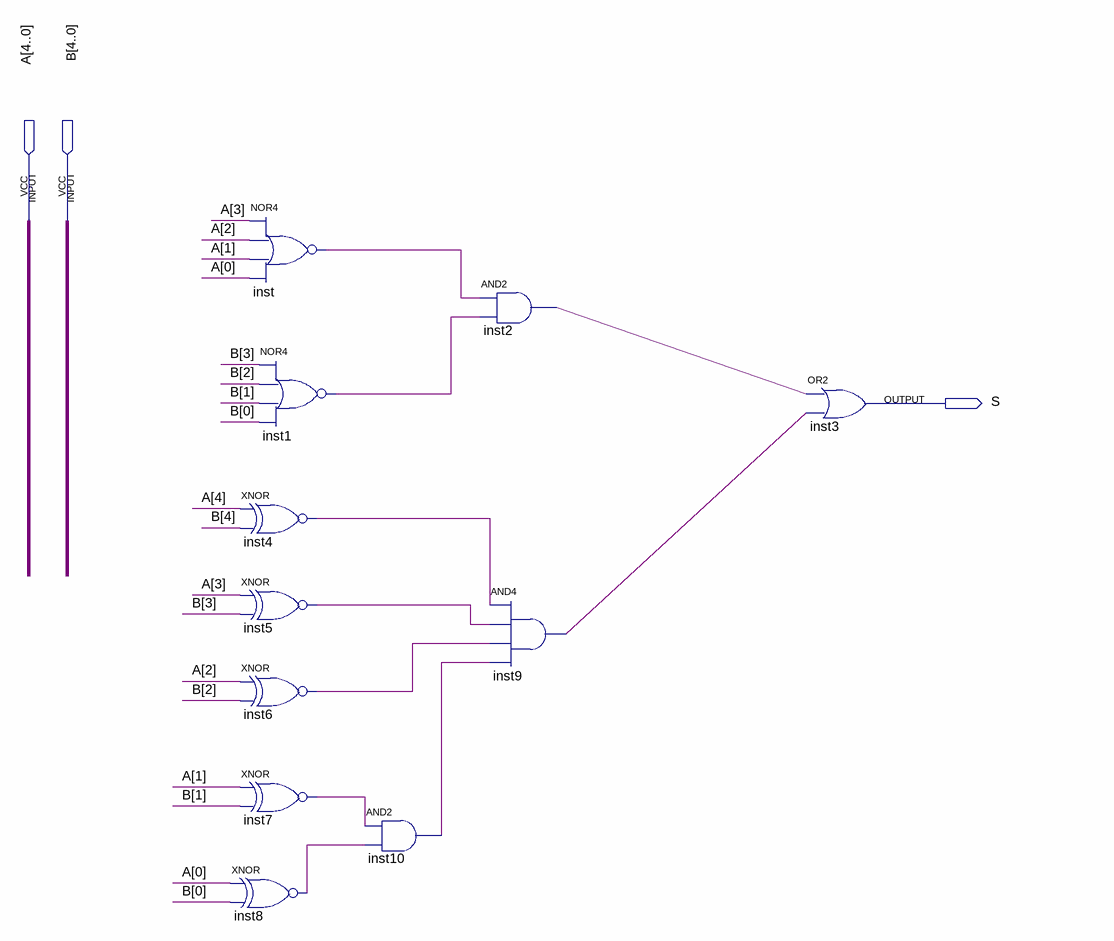
[diagram p0: schematic sheet]
// Quartus schematic comparadores_igual.bdf as structural Verilog: 11 symbols, 3 pins
module comparadores_igual (
  input  [4:0] A,
  input  [4:0] B,
  output S
);

  wire inst1_out, inst2_out, inst4_out, inst5_out, inst6_out, inst7_out, inst8_out, inst9_out, inst10_out,
       inst_out;

  nor inst (inst_out, A[3], A[2], A[1], A[0]);
  xnor inst4 (inst4_out, A[4], B[4]);
  xnor inst5 (inst5_out, A[3], B[3]);
  xnor inst6 (inst6_out, A[2], B[2]);
  xnor inst7 (inst7_out, A[1], B[1]);
  xnor inst8 (inst8_out, A[0], B[0]);
  nor inst1 (inst1_out, B[3], B[2], B[1], B[0]);
  and inst10 (inst10_out, inst7_out, inst8_out);
  and inst2 (inst2_out, inst_out, inst1_out);
  and inst9 (inst9_out, inst4_out, inst5_out, inst6_out, inst10_out);
  or inst3 (S, inst2_out, inst9_out);
endmodule
